# EasyEDA schematic SCH_Celec_Hackathon_j_2025-03-23.json
TITLE: Sheet_1; REV: 1.0; Date: 2025-03-22; Sheet: 1/1; Drawn By: ayoub12; Company: Your Company
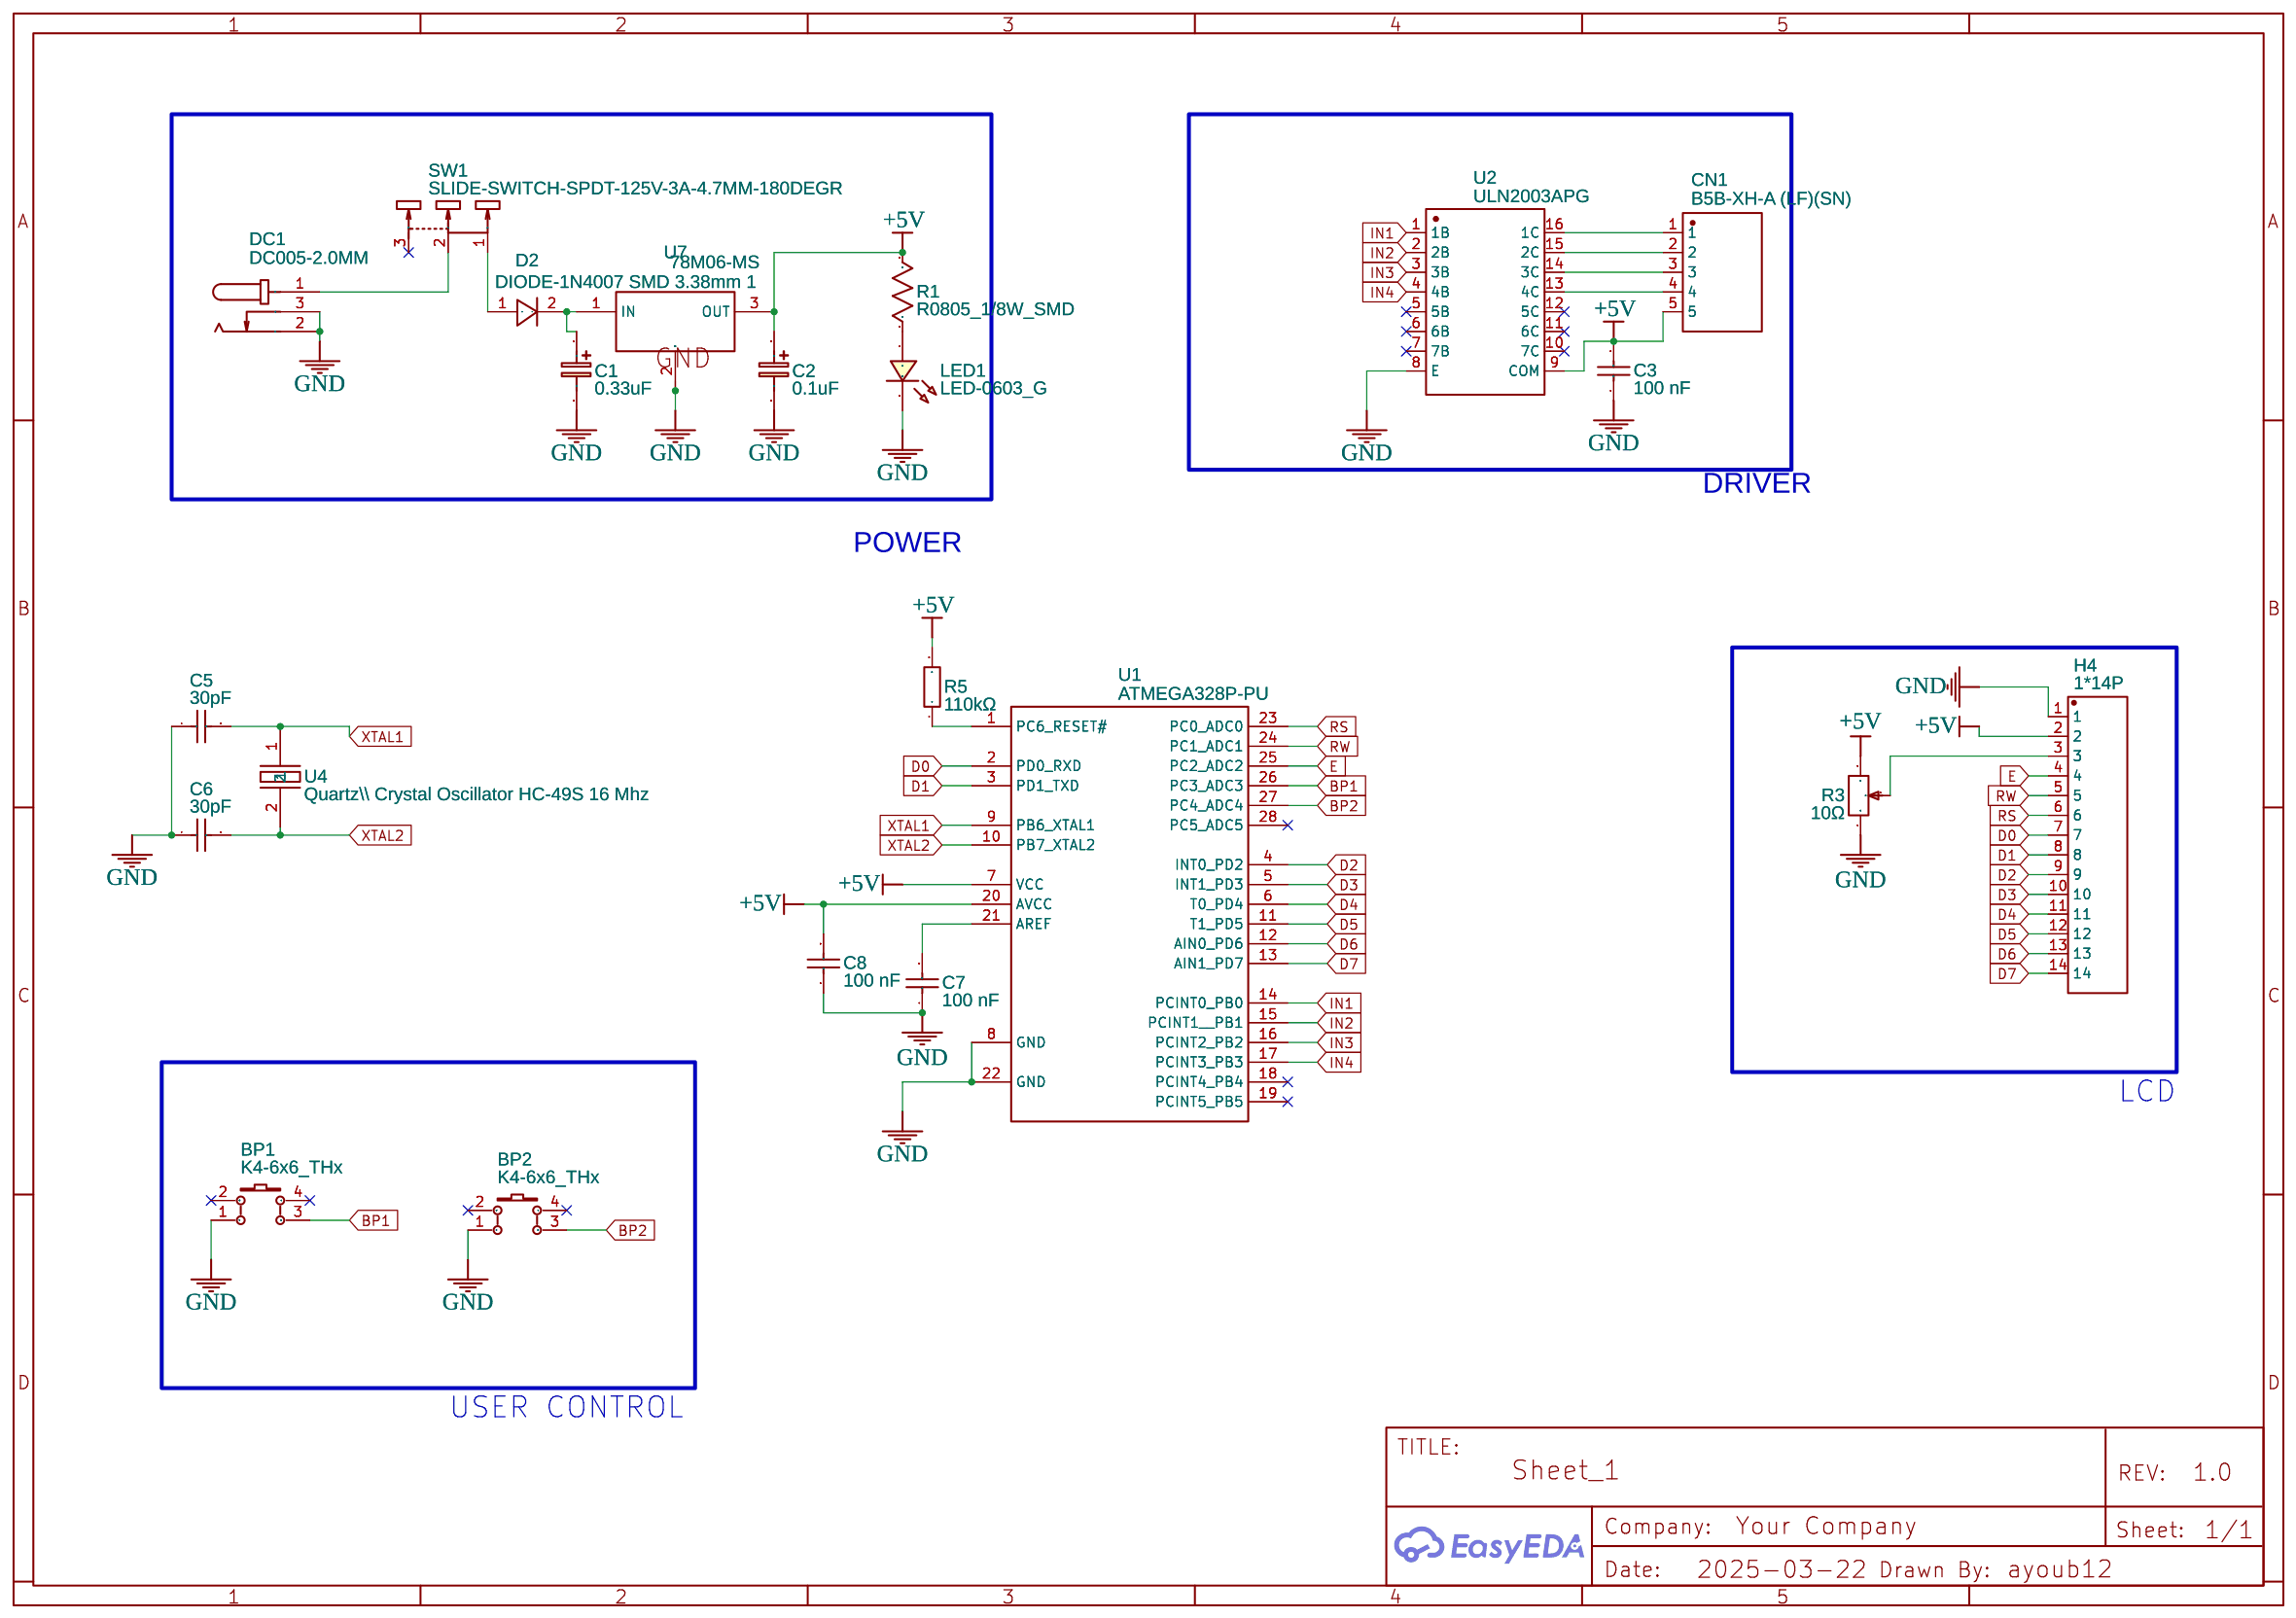
[diagram p0: schematic sheet]

## Parts
BP1  K4-6x6_THx  [K4_6X6_TH]
BP2  K4-6x6_THx  [K4_6X6_TH]
C1  0.33uF  [CAP-D3.0×F1.5]
C2  0.1uF  [CAP-D3.0×F1.5]
C3  100 nF  [CONDENSATEUR CERAMIQUE 100NF]
C5  30pF  [C0805]
C6  30pF  [C0805]
C7  100 nF  [CONDENSATEUR CERAMIQUE 100NF]
C8  100 nF  [CONDENSATEUR CERAMIQUE 100NF]
CN1  B5B-XH-A (LF)(SN)  [CONN-TH_B5B-XH-A-LF-SN]
D2  DIODE-1N4007 SMD 3.38mm 1  [DIODE-1N4007 SMD 3.38MM LAYOUT 1]
DC1  DC005-2.0MM  [DC-IN-TH_DC005]
H4  1*14P  [1X14P_MALE_HEADER]
LED1  LED-0603_G  [LED0603_GREEN]
R1  R0805_1/8W_SMD  [R0805_1/8W_SMD]
R3  10Ω  [RES-ADJ-TH_3362P]
R5  110kΩ  [RES-TH_BD2.3-L6.5-P10.50-D0.5]
SW1  SLIDE-SWITCH-SPDT-125V-3A-4.7MM-180DEGR  [SLIDE-SWITCH-SPDT-125V-3A-4.7MM-180DEGR-FP]
U1  ATMEGA328P-PU  [DIP-28_L34.6-W7.3-P2.54-LS10.2-BL]
U2  ULN2003APG  [DIP-16_L19.2-W6.6-P2.54-LS7.6-BL]
U4  Quartz\\ Crystal Oscillator HC-49S 16 Mhz  [QUARTZ CRYSTAL OSCILLATOR HC-49S 16 MHZ]
U7  78M06-MS  [TO-252-3_L6.6-W6.1-P4.57-LS9.9-BR-CW]

## Library data of the parts
BP1 BP2 = K4-6x6_THx: Convert to PCB: Yes; Add into BOM: Yes
C1 C2 = CE_TH_D3.0×F1.5_EU: Contributor: LCEDA_Lib
C3 C7 C8 = 100 nF: Contributor: Seaducer
C5 C6 = 0805CG300J500NT: Supplier: LCSC; Manufacturer: FH(风华); Supplier Part: C43094
CN1 = B5B-XH-A (LF)(SN): Contributor: LCSC; Supplier: LCSC; Supplier Part: C157991; Manufacturer: JST; Manufacturer Part: B5B-XH-A(LF)(SN); JLCPCB Part Class: Extended Part
D2 = DIODE-1N4007 SMD 3.38mm 1: Contributor: phatcomp_it
DC1 = DC005-2.0MM: Supplier: LCSC; Manufacturer: SOFNG; Supplier Part: C111567
H4 = 1*14P: Manufacturer: Ckmtw; Manufacturer Part: 210S-1*15P L=11.6MMGold-plated black; Contributor: closeau
LED1 = LED-0603_G: Manufacturer: EVERLIGHT(台湾亿光); Manufacturer Part: 19-217/GHC-YR1S2/3T; Supplier Part: C72043; Supplier: LCSC; Contributor: LCEDA_Lib
R1 = R0805_1/8W_SMD: Contributor: dr.alex
R3 = 3362P-1-100LF: Resistance(Ohms): 10; Supplier: LCSC; Manufacturer: BOURNS; Supplier Part: C124580; JLCPCB Part Class: Extended Part
R5 = CF1/4W-110KΩ±5% T52: Contributor: LCSC; Supplier: LCSC; Supplier Part: C120104; Manufacturer: CCO(千志电子); JLCPCB Part Class: Extended Part
SW1 = SLIDE-SWITCH-SPDT-125V-3A-4.7MM-180DEGR: Contributor: LCSC; Supplier: LCSC; Supplier Part: C319013; Manufacturer: XKB Connectivity(中国星坤); Manufacturer Part: SS-12D10L3; JLCPCB Part Class: Extended Part
U1 = ATMEGA328P-PU: sourceId: Oic6oiASL; Contributor: LCSC; Supplier: LCSC; Manufacturer: MICROCHIP(美国微芯); Supplier Part: C33901; JLCPCB Part Class: Extended Part
U2 = ULN2003APG: Supplier: LCSC; Manufacturer: TOSHIBA(东芝); Supplier Part: C5251
U4 = Quartz\\ Crystal Oscillator HC-49S 16 Mhz: Contributor: zibaldino
U7 = 78M06-MS: Contributor: lcsc; Supplier: LCSC; Supplier Part: C5174621; Manufacturer: MSKSEMI(美森科)

## Nets
+5V: C2.1 C3.2 C8.2 CN1.5 H4.2 R1.2 R3.1 R5.2 U1.7(VCC) U1.20(AVCC) U2.9(COM) U7.3(OUT)
GND: BP1.1 BP2.1 C1.2 C2.2 C3.1 C5.1 C6.1 C7.1 C8.1 DC1.2 DC1.3 H4.1 LED1.2 R3.3 U1.8(GND) U1.22(GND) U2.8(E) U7.2(GND)
BP1: BP1.3 U1.26(PC3 ADC3)
BP2: BP2.3 U1.27(PC4 ADC4)
D0: H4.7 U1.2(PD0 RXD)
D1: H4.8 U1.3(PD1 TXD)
D2: H4.9 U1.4(INT0 PD2)
D3: H4.10 U1.5(INT1 PD3)
D4: H4.11 U1.6(T0 PD4)
D5: H4.12 U1.11(T1 PD5)
D6: H4.13 U1.12(AIN0 PD6)
D7: H4.14 U1.13(AIN1 PD7)
E: H4.4 U1.25(PC2 ADC2)
IN1: U1.14(PCINT0 PB0) U2.1(1B)
IN2: U1.15(PCINT1  PB1) U2.2(2B)
IN3: U1.16(PCINT2 PB2) U2.3(3B)
IN4: U1.17(PCINT3 PB3) U2.4(4B)
RS: H4.6 U1.23(PC0 ADC0)
RW: H4.5 U1.24(PC1 ADC1)
XTAL1: C5.2 U1.9(PB6 XTAL1) U4.1
XTAL2: C6.2 U1.10(PB7 XTAL2) U4.2
Net-(C1-1): C1.1 D2.2(-) U7.1(IN)
Net-(C7-2): C7.2 U1.21(AREF)
Net-(CN1-1): CN1.1 U2.16(1C)
Net-(CN1-2): CN1.2 U2.15(2C)
Net-(CN1-3): CN1.3 U2.14(3C)
Net-(CN1-4): CN1.4 U2.13(4C)
Net-(D2-1): D2.1(+) SW1.1
Net-(DC1-1): DC1.1 SW1.2
Net-(H4-3): H4.3 R3.2
Net-(LED1-1): LED1.1 R1.1
Net-(R5-1): R5.1 U1.1(PC6 RESET#)

Not connected (* = marked no-connect by the designer): BP1 2* 4*; BP2 2* 4*; SW1 3*; U1 18(PCINT4 PB4)* 19(PCINT5 PB5)* 28(PC5 ADC5)*; U2 5(5B)* 6(6B)* 7(7B)* 10(7C)* 11(6C)* 12(5C)*

## Notes on the sheet
- DRIVER
- POWER
- LCD
- USER CONTROL
